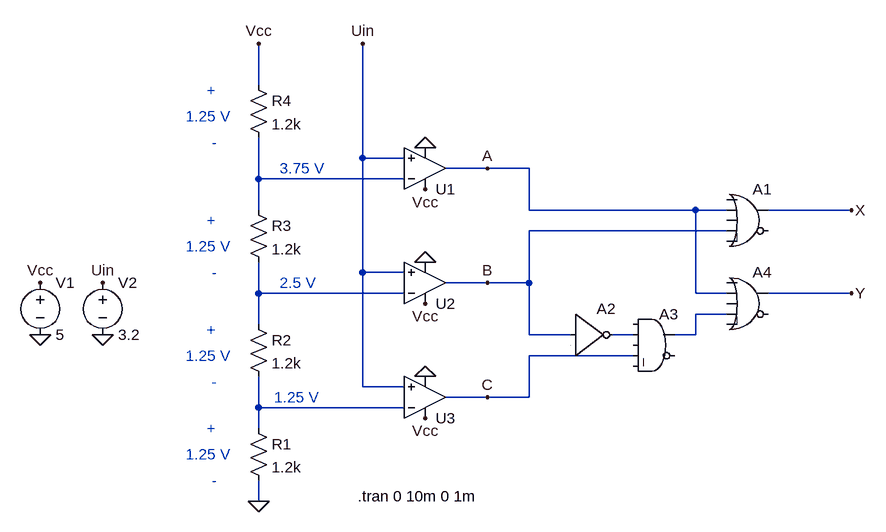
[diagram p0: schematic adc.asc]
adc.asc, the LTspice schematic file:
Version 4.1
SHEET 1 1472 840
WIRE 528 -256 528 -320
WIRE 688 -144 688 -320
WIRE 752 -144 688 -144
WIRE 880 -128 816 -128
WIRE 944 -128 880 -128
WIRE 528 -112 528 -176
WIRE 752 -112 528 -112
WIRE 528 -64 528 -112
WIRE 944 -64 944 -128
WIRE 1200 -64 944 -64
WIRE 1248 -64 1200 -64
WIRE 1440 -64 1312 -64
WIRE 1248 -32 944 -32
WIRE 688 32 688 -144
WIRE 752 32 688 32
WIRE 880 48 816 48
WIRE 944 48 944 -32
WIRE 944 48 880 48
WIRE 528 64 528 16
WIRE 752 64 528 64
WIRE 1200 64 1200 -64
WIRE 1248 64 1200 64
WIRE 1440 64 1312 64
WIRE 1248 96 1200 96
WIRE 528 112 528 64
WIRE 944 128 944 48
WIRE 1008 128 944 128
WIRE 1104 128 1072 128
WIRE 1200 128 1200 96
WIRE 1200 128 1168 128
WIRE 1104 160 944 160
WIRE 688 208 688 32
WIRE 752 208 688 208
WIRE 880 224 816 224
WIRE 944 224 944 160
WIRE 944 224 880 224
WIRE 528 240 528 192
WIRE 752 240 528 240
WIRE 528 272 528 240
WIRE 528 384 528 352
FLAG 192 128 0
FLAG 288 128 0
FLAG 192 48 Vcc
FLAG 288 48 Uin
FLAG 528 384 0
FLAG 528 -320 Vcc
FLAG 784 16 0
FLAG 784 -160 0
FLAG 784 192 0
FLAG 784 -96 Vcc
FLAG 784 80 Vcc
FLAG 784 256 Vcc
FLAG 688 -320 Uin
FLAG 880 -128 A
FLAG 880 48 B
FLAG 880 224 C
FLAG 1440 -64 X
FLAG 1440 64 Y
SYMBOL voltage 192 32 R0
WINDOW 123 0 0 Left 0
WINDOW 39 0 0 Left 0
SYMATTR InstName V1
SYMATTR Value 5
SYMBOL voltage 288 32 R0
WINDOW 123 0 0 Left 0
WINDOW 39 0 0 Left 0
SYMATTR InstName V2
SYMATTR Value 3.2
SYMBOL res 512 256 R0
SYMATTR InstName R1
SYMATTR Value 1.2k
SYMBOL res 512 96 R0
SYMATTR InstName R2
SYMATTR Value 1.2k
SYMBOL res 512 -80 R0
SYMATTR InstName R3
SYMATTR Value 1.2k
SYMBOL res 512 -272 R0
SYMATTR InstName R4
SYMATTR Value 1.2k
SYMBOL OpAmps\\UniversalOpAmp2 784 -128 M180
SYMATTR InstName U1
SYMBOL OpAmps\\UniversalOpAmp2 784 48 M180
SYMATTR InstName U2
SYMBOL OpAmps\\UniversalOpAmp2 784 224 M180
SYMATTR InstName U3
SYMBOL Digital\\or 1280 -112 R0
SYMATTR InstName A1
SYMBOL Digital\\inv 1008 64 R0
SYMATTR InstName A2
SYMBOL Digital\\and 1136 80 R0
SYMATTR InstName A3
SYMBOL Digital\\or 1280 16 R0
SYMATTR InstName A4
TEXT 680 376 Left 2 !.tran 0 10m 0 1m
TEXT 448 -248 Left 2 ;+
TEXT 456 -168 Left 2 ;-
TEXT 416 -208 Left 2 ;1.25 V
TEXT 448 -48 Left 2 ;+
TEXT 456 32 Left 2 ;-
TEXT 416 -8 Left 2 ;1.25 V
TEXT 448 120 Left 2 ;+
TEXT 456 200 Left 2 ;-
TEXT 416 160 Left 2 ;1.25 V
TEXT 448 272 Left 2 ;+
TEXT 456 352 Left 2 ;-
TEXT 416 312 Left 2 ;1.25 V
TEXT 560 -128 Left 2 ;3.75 V
TEXT 560 48 Left 2 ;2.5 V
TEXT 552 224 Left 2 ;1.25 V

The netlist it stands for:
* adc.asc
V1 Vcc 0 5
V2 Uin 0 3.2
R1 N005 0 1.2k
R2 N002 N005 1.2k
R3 N001 N002 1.2k
R4 Vcc N001 1.2k
X§U1 Uin N001 Vcc 0 A level2 Avol=1Meg GBW=10Meg Slew=10Meg Ilimit=25m Rail=0 Vos=0 En=0 Enk=0 In=0 Ink=0 Rin=500Meg  ; pins In+ In- V+ V- OUT
X§U2 Uin N002 Vcc 0 B level2 Avol=1Meg GBW=10Meg Slew=10Meg Ilimit=25m Rail=0 Vos=0 En=0 Enk=0 In=0 Ink=0 Rin=500Meg  ; pins In+ In- V+ V- OUT
X§U3 Uin N005 Vcc 0 C level2 Avol=1Meg GBW=10Meg Slew=10Meg Ilimit=25m Rail=0 Vos=0 En=0 Enk=0 In=0 Ink=0 Rin=500Meg  ; pins In+ In- V+ V- OUT
A1 0 A 0 B 0 0 X 0 OR
A2 B 0 0 0 0 N004 0 0 BUF
A3 0 N004 0 C 0 0 N003 0 AND
A4 0 A 0 N003 0 0 Y 0 OR
.tran 0 10m 0 1m
* +
* -
* 1.25 V
* +
* -
* 1.25 V
* +
* -
* 1.25 V
* +
* -
* 1.25 V
* 3.75 V
* 2.5 V
* 1.25 V
.lib UniversalOpAmp2.lib
.backanno
.end